# Altium project Quadrotor.PrjPcb (part 1 of 2)
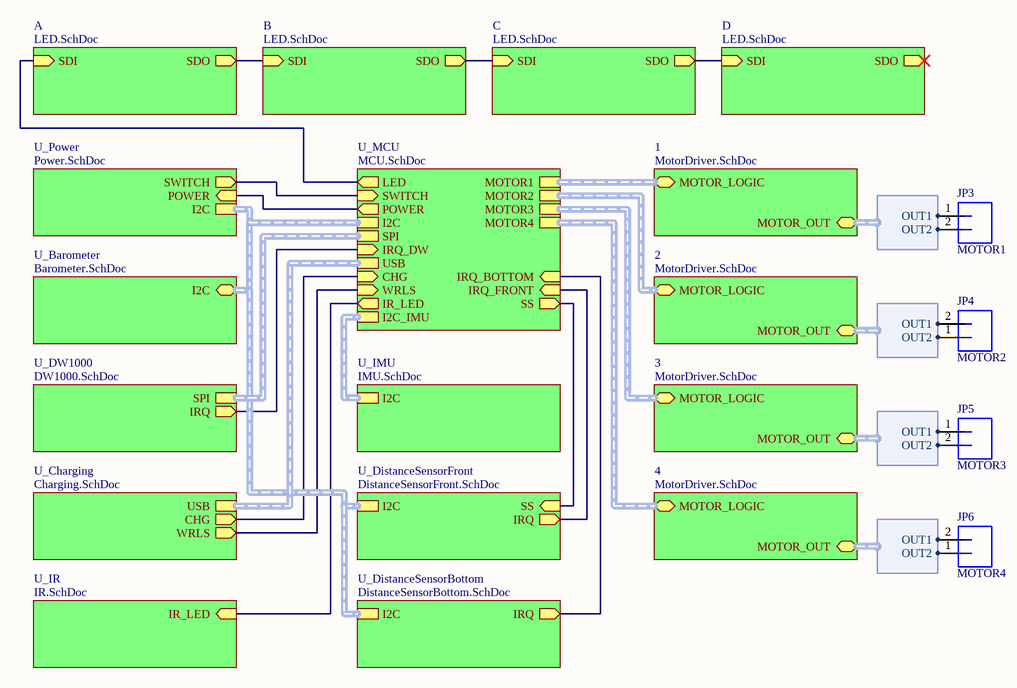
[diagram p0: Quadrotor.SchDoc]
12 sheets, 189 parts. Net scope: hierarchical (ports join the sheet entries above them; power ports are global).
Board file: Quadrotor.PcbDoc
Sheets:
  Quadrotor.SchDoc
    1 = MotorDriver.SchDoc
    2 = MotorDriver.SchDoc
    3 = MotorDriver.SchDoc
    4 = MotorDriver.SchDoc
    A = LED.SchDoc
    D = LED.SchDoc
    B = LED.SchDoc
    C = LED.SchDoc
    U_Barometer = Barometer.SchDoc
    U_DistanceSensorFront = DistanceSensorFront.SchDoc
    U_MCU = MCU.SchDoc
    U_IMU = IMU.SchDoc
    U_Charging = Charging.SchDoc
    U_DW1000 = DW1000.SchDoc
    U_Power = Power.SchDoc
    U_IR = IR.SchDoc
    U_DistanceSensorBottom = DistanceSensorBottom.SchDoc

## Sheet Quadrotor.SchDoc
size A; SheetNumber: 1

### Parts
JP3  MOTOR1  [MOLEX-PICOBLADE-1.25MM-2-HORZ-SMD]
JP4  MOTOR2  [MOLEX-PICOBLADE-1.25MM-2-HORZ-SMD]
JP5  MOTOR3  [MOLEX-PICOBLADE-1.25MM-2-HORZ-SMD]
JP6  MOTOR4  [MOLEX-PICOBLADE-1.25MM-2-HORZ-SMD]

### Sub-sheets
1 = MotorDriver.SchDoc: MOTOR_LOGIC (harness Motor), MOTOR_OUT (harness MotorOutput)
2 = MotorDriver.SchDoc: MOTOR_LOGIC (harness Motor), MOTOR_OUT (harness MotorOutput)
3 = MotorDriver.SchDoc: MOTOR_LOGIC (harness Motor), MOTOR_OUT (harness MotorOutput)
4 = MotorDriver.SchDoc: MOTOR_LOGIC (harness Motor), MOTOR_OUT (harness MotorOutput)
A = LED.SchDoc: SDI (in), SDO (out)
B = LED.SchDoc: SDI (in), SDO (out)
C = LED.SchDoc: SDI (in), SDO (out)
D = LED.SchDoc: SDI (in), SDO (out)
U_Barometer = Barometer.SchDoc: I2C (harness I2C)
U_Charging = Charging.SchDoc: USB (harness USB), CHG (out), WRLS (out)
U_DistanceSensorBottom = DistanceSensorBottom.SchDoc: I2C (harness I2C), IRQ (out)
U_DistanceSensorFront = DistanceSensorFront.SchDoc: I2C (harness I2C), IRQ (out), SS (in)
U_DW1000 = DW1000.SchDoc: SPI (harness SPI), IRQ (out)
U_IMU = IMU.SchDoc: I2C (harness I2C)
U_IR = IR.SchDoc: IR_LED (in)
U_MCU = MCU.SchDoc: USB (harness USB), I2C (harness I2C), SPI (harness SPI), LED (out), CHG (in), I2C_IMU (harness I2C), SWITCH (in), POWER (out), MOTOR1 (harness Motor), MOTOR2 (harness Motor), MOTOR3 (harness Motor), MOTOR4 (harness Motor), SS (out), IRQ_FRONT (in), WRLS (in), IR_LED (out), IRQ_BOTTOM (in), IRQ_DW (in)
U_Power = Power.SchDoc: SWITCH (out), POWER (in), I2C (harness I2C)

### Harnesses
MotorOutput: OUT1, OUT2

### Nets
NetD2_C: sheet U_MCU/CHG, sheet U_Charging/CHG
NetD3_C: sheet U_MCU/WRLS, sheet U_Charging/WRLS
NetJP3_1: JP3.1 ; sheet 1/MOTOR_OUT.OUT1
NetJP3_2: JP3.2 ; sheet 1/MOTOR_OUT.OUT2
NetJP4_1: JP4.1 ; sheet 2/MOTOR_OUT.OUT2
NetJP4_2: JP4.2 ; sheet 2/MOTOR_OUT.OUT1
NetJP5_1: JP5.1 ; sheet 3/MOTOR_OUT.OUT1
NetJP5_2: JP5.2 ; sheet 3/MOTOR_OUT.OUT2
NetJP6_1: JP6.1 ; sheet 4/MOTOR_OUT.OUT2
NetJP6_2: JP6.2 ; sheet 4/MOTOR_OUT.OUT1
NetR6_1: sheet U_MCU/SWITCH, sheet U_Power/SWITCH
NetR6_2: sheet U_MCU/POWER, sheet U_Power/POWER
NetR34_1: sheet U_MCU/IR_LED, sheet U_IR/IR_LED
NetU1_22: sheet A/SDI, sheet U_MCU/LED
NetU1_26: sheet U_MCU/IRQ_BOTTOM, sheet U_DistanceSensorBottom/IRQ
NetU1_27: sheet U_DistanceSensorFront/IRQ, sheet U_MCU/IRQ_FRONT
NetU1_28: sheet U_DistanceSensorFront/SS, sheet U_MCU/SS
NetU1_54: sheet U_MCU/IRQ_DW, sheet U_DW1000/IRQ
NetU10_A_5: sheet A/SDO, sheet B/SDI
NetU10_B_5: sheet B/SDO, sheet C/SDI
NetU10_C_5: sheet D/SDI, sheet C/SDO

### Buses and harness runs
harness sheet 1/MOTOR_LOGIC = sheet U_MCU/MOTOR1
harness sheet 2/MOTOR_LOGIC = sheet U_MCU/MOTOR2
harness sheet 3/MOTOR_LOGIC = sheet U_MCU/MOTOR3
harness sheet 4/MOTOR_LOGIC = sheet U_MCU/MOTOR4
harness sheet U_Barometer/I2C = sheet U_DistanceSensorBottom/I2C = sheet U_DistanceSensorFront/I2C = sheet U_MCU/I2C = sheet U_Power/I2C
harness sheet U_Charging/USB = sheet U_MCU/USB
harness sheet U_DW1000/SPI = sheet U_MCU/SPI
harness sheet U_IMU/I2C = sheet U_MCU/I2C_IMU

### Library data of the parts
JP3-JP6 = MOLEX_PICOBLADE_1.25MM_2_HORZ_SMD: Manufacturer: Molex; PartNumber: 53261-0271; Mounting Technology: Surface Mount; PackageReference: PicoBlade-1.25mm

## Sheet MotorDriver.SchDoc
size A; SheetNumber: 5
Used 4 times, as channels 1, 2, 3, 4. Parts and nets are listed once, with the designators drawn on the sheet.
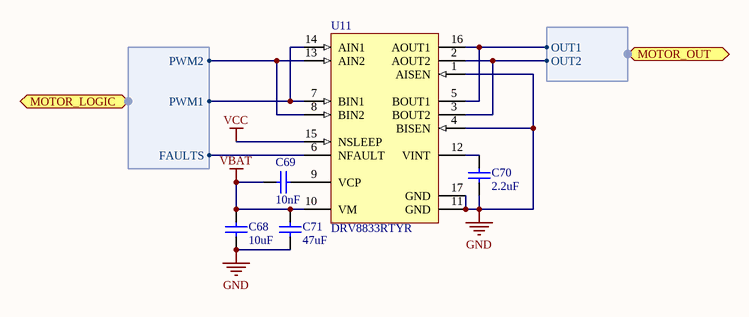
[diagram p1: MotorDriver.SchDoc]

### Parts
C68  value 10uF  [C0603[1608X92]]  (hidden comment: 10uF 16V 0603)
C69  value 10nF  [C0402[1005X55]]  (hidden comment: 10nF 50V 0402)
C70  value 2.2uF  [C0402[1005X55]]  (hidden comment: 2.2uF 6.3V 0402)
C71  value 47uF  [C1206[3216X160]]  (hidden comment: 47uF 6.3V 1206)
U11  DRV8833RTYR  [QFN-16 (0.65mm)]

### Ports
MOTOR_LOGIC (harness Motor), MOTOR_OUT (harness MotorOut)

### Harnesses
Motor: FAULTS, PWM2, PWM1
MotorOut: OUT1, OUT2

### Nets
GND: C68.1 C70.1 C71.2 U11.1(AISEN) U11.4(BISEN) U11.11(GND) U11.17(GND)
VBAT: C68.2 C69.1 C71.1 U11.10(VM)
VCC: U11.15(NSLEEP)
NetC69_2: C69.2 U11.9(VCP)
NetC70_2: C70.2 U11.12(VINT)
NetU11_2: U11.2(AOUT2) U11.3(BOUT2) ; port MOTOR_OUT.OUT2
NetU11_5: U11.5(BOUT1) U11.16(AOUT1) ; port MOTOR_OUT.OUT1
NetU11_6: U11.6(NFAULT) ; port MOTOR_LOGIC.FAULTS
NetU11_7: U11.7(BIN1) U11.14(AIN1) ; port MOTOR_LOGIC.PWM1
NetU11_8: U11.8(BIN2) U11.13(AIN2) ; port MOTOR_LOGIC.PWM2

### Channels
1: designators end in _1
2: designators end in _2
3: designators end in _3
4: designators end in _4

### Library data of the parts
C68 = CAP_10uF_16V_0603_10%: 10uF 16V 10% 0603 (1608 Metric); PartNumber: GRM188R61C106KAALD; Manufacturer: Murata; Mounting Technology: Surface Mount; PackageReference: 0603; PackageDescription: 0603 (1608 Metric); Voltage: 16V; Tolerance: 10%
C69 = CAP_10nF_50V_0402_10%: 10nF 50V 10% 0402 (1005 Metric); PartNumber: GCM155R71H103KA55D; Manufacturer: Murata; Mounting Technology: Surface Mount; PackageReference: 0402; PackageDescription: 0402 (1005 Metric); Voltage: 50V; Tolerance: 10%
C70 = CAP_2.2uF_6.3V_0402_20%: 2.2uF 6.3V 20% 0402 (1005 Metric); PartNumber: GRM155R60J225ME15D; Manufacturer: Murata; Mounting Technology: Surface Mount; PackageReference: 0402; PackageDescription: 0402 (1005 Metric); Voltage: 6.3V; Tolerance: 20%
C71 = CAP_47uF_6.3V_1206_10%: 47uF 6.3V 10% 1206 (3216 Metric); PartNumber: GRM31CR60J476KE19L; Manufacturer: Murata; Mounting Technology: Surface Mount; PackageReference: 1206; PackageDescription: 1206 (3216 Metric); Voltage: 6.3V; Tolerance: 10%
U11 = DRV8833RTYR: Manufacturer: Texas Instruments; Mounting Technology: Surface Mount; PartNumber: DRV8833RTYR; PackageReference: QFN-16

## Sheet LED.SchDoc
size A; SheetNumber: 10
Used 4 times, as channels A, D, B, C. Parts and nets are listed once, with the designators drawn on the sheet.
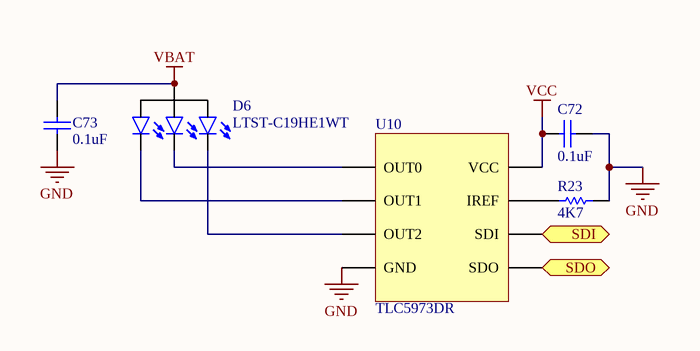
[diagram p2: LED.SchDoc]

### Parts
C72  value 0.1uF  [C0402[1005X55]]  (hidden comment: 0.1uF 6.3V 0402)
C73  value 0.1uF  [C0402[1005X55]]  (hidden comment: 0.1uF 6.3V 0402)
D6  LTST-C19HE1WT  [LED0606]
R23  value 4K7  [R0402[1005]]  (hidden comment: 4K7 1% 0402)
U10  TLC5973DR  [SOIC-8]

### Ports
SDI (in), SDO (out)

### Nets
GND: C72.2 C73.1 R23.1 U10.4(GND)
VBAT: C73.2 D6.4(A)
VCC: C72.1 U10.8(VCC)
SDI: U10.6(SDI) ; port SDI
SDO: U10.5(SDO) ; port SDO
NetD6_1: D6.1(K_Red) U10.3(OUT2)
NetD6_2: D6.2(K_Green) U10.1(OUT0)
NetD6_3: D6.3(K_Blue) U10.2(OUT1)
NetR23_2: R23.2 U10.7(IREF)

### Channels
A: designators end in _A; ports SDI=NetU1_22 SDO=NetU10_A_5
D: designators end in _D; ports SDI=NetU10_C_5 SDO=NetU10_D_5
B: designators end in _B; ports SDI=NetU10_A_5 SDO=NetU10_B_5
C: designators end in _C; ports SDI=NetU10_B_5 SDO=NetU10_C_5

### Library data of the parts
C72 C73 = CAP_0.1uF_6.3V_0402_10%: 0.1uF 6.3V 10% 0402 (1005 Metric); PartNumber: GRM155R70J104KA01D; Manufacturer: Murata; Mounting Technology: Surface Mount; PackageReference: 0402; PackageDescription: 0402 (1005 Metric); Voltage: 6.3V; Tolerance: 10%
D6 = LTST-C19HE1WT: Manufacturer: Lite-On Inc.; PartNumber: LTST-C19HE1WT; PackageReference: 0606; Mounting Technology: Surface Mount; PackageDescription: 0606 (1616 Metric)
R23 = RES_4K7_0402_1%: 4K7 0.063W 1% 0402 (1005 Metric); Manufacturer: KOA Speer; PartNumber: RK73H1ETTP4701F; Tolerance: 1%; Power: 0.063W; Mounting Technology: Surface Mount; PackageReference: 0402; PackageDescription: 0402 (1005 Metric); ComponentLink1Description: Datasheet; ComponentLink1URL: http://www.koaspeer.com/catimages/Products/RK73H/RK73H.pdf
U10 = TLC5973DR: LED Lighting Drivers 3Ch 12B PWM Constant Crnt LED Dvr; Manufacturer: Texas Instruments; PartNumber: TLC5973DR; Mounting Technology: Surface Mount; PackageReference: SOIC-8

## Sheet Barometer.SchDoc
size A; SheetNumber: 9
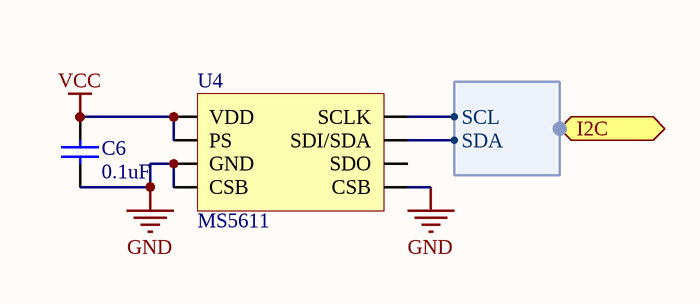
[diagram p3: Barometer.SchDoc]

### Parts
C6  value 0.1uF  [C0402[1005X55]]  (hidden comment: 0.1uF 6.3V 0402)
U4  MS5611  [MS5611]

### Ports
I2C (harness I2C)

### Harnesses
I2C: SCL, SDA

### Nets
GND: C6.1 U4.3(GND) U4.4(CSB) U4.5(CSB)
VCC: C6.2 U4.1(VDD) U4.2(PS)
I2C.SCL: U4.8(SCLK) ; port I2C.SCL
I2C.SDA: U4.7(SDI/SDA) ; port I2C.SDA

Not connected (* = marked no-connect by the designer): U4 6(SDO)

### Library data of the parts
C6 = CAP_0.1uF_6.3V_0402_10%: as C72 on sheet LED; Tolerance: 10%; Mounting Technology: Surface Mount; PackageReference: 0402; PackageDescription: 0402 (1005 Metric); Voltage: 6.3V

## Sheet DistanceSensorFront.SchDoc
size A; SheetNumber: 8
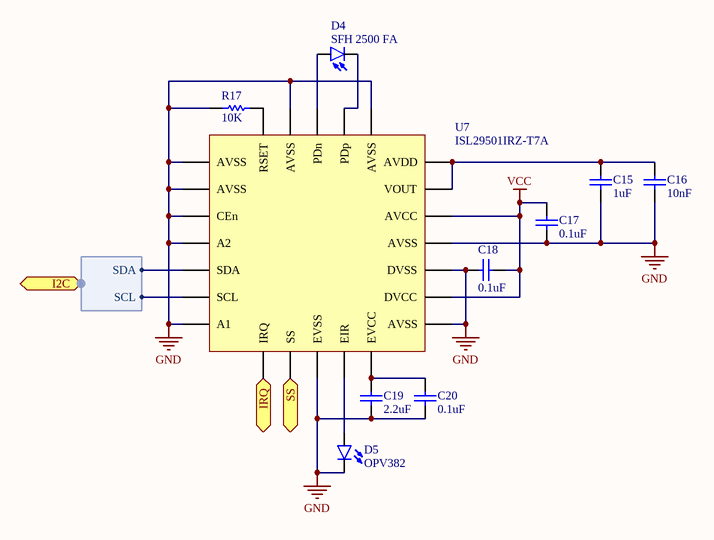
[diagram p4: DistanceSensorFront.SchDoc]

### Parts
C15  value 1uF  [C0402[1005X55]]  (hidden comment: 1uF 6.3V 0402)
C16  value 10nF  [C0402[1005X55]]  (hidden comment: 10nF 50V 0402)
C17  value 0.1uF  [C0402[1005X55]]  (hidden comment: 0.1uF 6.3V 0402)
C18  value 0.1uF  [C0402[1005X55]]  (hidden comment: 0.1uF 6.3V 0402)
C19  value 2.2uF  [C0402[1005X55]]  (hidden comment: 2.2uF 6.3V 0402)
C20  value 0.1uF  [C0402[1005X55]]  (hidden comment: 0.1uF 6.3V 0402)
D4  SFH 2500 FA  [SFH 2500 FA]
D5  OPV382  [OPV382]
R17  value 10K  [R0402[1005]]  (hidden comment: 10K 1% 0402)
U7  ISL29501IRZ-T7A  [QFN-24]

### Ports
I2C (harness I2C), IRQ (out), SS (in)

### Harnesses
I2C: SCL, SDA

### Nets
GND: C15.1 C16.1 C17.2 C18.2 C19.1 C20.1 D5.1(C) R17.1 U7.1(AVSS) U7.2(AVSS) U7.3(CEn) U7.4(A2) U7.7(A1) U7.10(EVSS) U7.13(AVSS) U7.15(DVSS) U7.16(AVSS) U7.20(AVSS) U7.23(AVSS)
VCC: C17.1 C18.1 U7.14(DVCC) U7.17(AVCC)
I2C.SCL: U7.6(SCL) ; port I2C.SCL
I2C.SDA: U7.5(SDA) ; port I2C.SDA
NetC15_2: C15.2 C16.2 U7.18(VOUT) U7.19(AVDD)
NetC19_2: C19.2 C20.2 U7.12(EVCC)
NetD4_1: D4.1(C) U7.21(PDp)
NetD4_2: D4.2(A) U7.22(PDn)
NetD5_2: D5.2(A) U7.11(EIR)
NetR17_2: R17.2 U7.24(RSET)
NetU1_27: U7.8(IRQ) ; port IRQ
NetU1_28: U7.9(SS) ; port SS

### Library data of the parts
C15 = CAP_1uF_6.3V_0402_10%: 1uF 6.3V 10% 0402 (1005 Metric); PartNumber: GRM155R70J105KA12D; Manufacturer: Murata; Mounting Technology: Surface Mount; PackageReference: 0402; PackageDescription: 0402 (1005 Metric); Voltage: 6.3V; Tolerance: 10%
C16 = CAP_10nF_50V_0402_10%: as C69 on sheet MotorDriver; Mounting Technology: Surface Mount; PackageReference: 0402; PackageDescription: 0402 (1005 Metric); Voltage: 50V; Tolerance: 10%
C17 C18 C20 = CAP_0.1uF_6.3V_0402_10%: as C72 on sheet LED; Mounting Technology: Surface Mount; PackageReference: 0402; PackageDescription: 0402 (1005 Metric); Voltage: 6.3V; Tolerance: 10%
C19 = CAP_2.2uF_6.3V_0402_20%: as C70 on sheet MotorDriver; Mounting Technology: Surface Mount; PackageReference: 0402; PackageDescription: 0402 (1005 Metric); Voltage: 6.3V; Tolerance: 20%
D4 = SFH 2500 FA: Manufacturer: Osram; PartNumber: SFH 2500 FA; Mounting Technology: Surface Mount
D5 = OPV382: Manufacturer: OPTEK Technology; PartNumber: OPV382; Mounting Technology: Through Hole
R17 = RES_10K_0402_1%: 10K 0.063W 1% 0402 (1005 Metric); Manufacturer: KOA Speer; PartNumber: RK73H1ETTP1002F; Tolerance: 1%; Power: 0.063W; Mounting Technology: Surface Mount; PackageReference: 0402; PackageDescription: 0402 (1005 Metric); ComponentLink1Description: Datasheet; ComponentLink1URL: http://www.koaspeer.com/catimages/Products/RK73H/RK73H.pdf
U7 = ISL29501IRZ-T7A: IC TOF SIGNAL PROCESSOR 24QFN; pin to pad: 23>23+25; Manufacturer: Intersil; PartNumber: ISL29501IRZ-T7A; Mounting Technology: Surface Mount; PackageReference: QFN-24

## Sheet MCU.SchDoc
size A; SheetNumber: 2
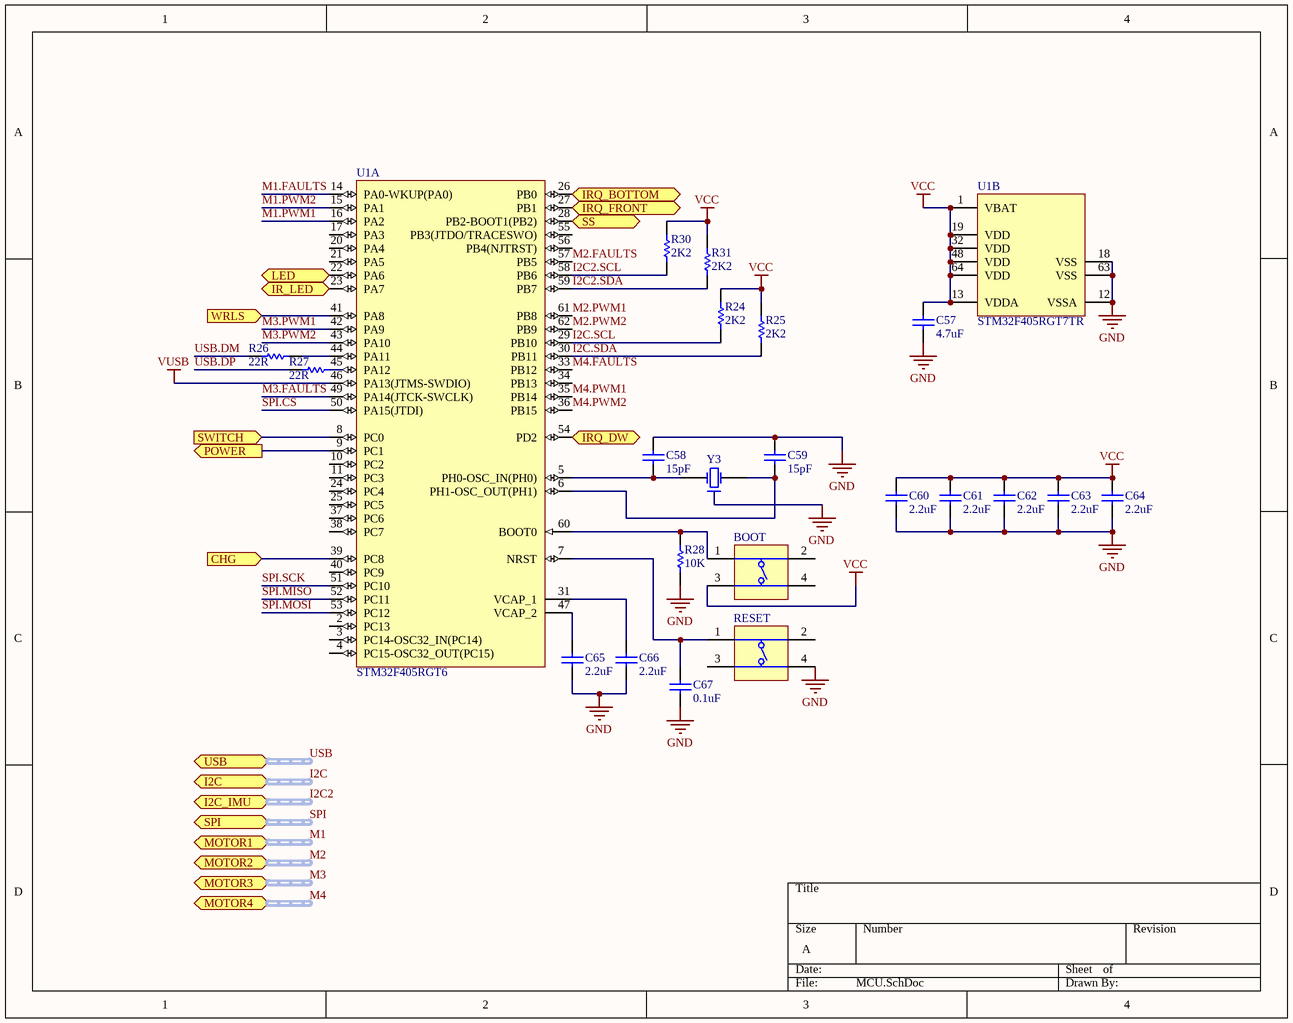
[diagram p5: MCU.SchDoc]

### Parts
BOOT  (no value)  [SWITCH]
C57  value 4.7uF  [C0402[1005X55]]  (hidden comment: 4.7uF 6.3V 0402)
C58  value 15pF  [C0402[1005X55]]  (hidden comment: 15pF 50V 0402)
C59  value 15pF  [C0402[1005X55]]  (hidden comment: 15pF 50V 0402)
C60  value 2.2uF  [C0402[1005X55]]  (hidden comment: 2.2uF 6.3V 0402)
C61  value 2.2uF  [C0402[1005X55]]  (hidden comment: 2.2uF 6.3V 0402)
C62  value 2.2uF  [C0402[1005X55]]  (hidden comment: 2.2uF 6.3V 0402)
C63  value 2.2uF  [C0402[1005X55]]  (hidden comment: 2.2uF 6.3V 0402)
C64  value 2.2uF  [C0402[1005X55]]  (hidden comment: 2.2uF 6.3V 0402)
C65  value 2.2uF  [C0402[1005X55]]  (hidden comment: 2.2uF 6.3V 0402)
C66  value 2.2uF  [C0402[1005X55]]  (hidden comment: 2.2uF 6.3V 0402)
C67  value 0.1uF  [C0402[1005X55]]  (hidden comment: 0.1uF 6.3V 0402)
R24  value 2K2  [R0402[1005]]  (hidden comment: 2K2 1% 0402)
R25  value 2K2  [R0402[1005]]  (hidden comment: 2K2 1% 0402)
R26  value 22R  [R0402[1005]]  (hidden comment: 22R 1% 0402)
R27  value 22R  [R0402[1005]]  (hidden comment: 22R 1% 0402)
R28  value 10K  [R0402[1005]]  (hidden comment: 10K 1% 0402)
R30  value 2K2  [R0402[1005]]  (hidden comment: 2K2 1% 0402)
R31  value 2K2  [R0402[1005]]  (hidden comment: 2K2 1% 0402)
RESET  (no value)  [SWITCH]
U1  STM32F405RGT6  [STM-LQFP64_L]  (parts A,B of 2)
Y3  (no value)  [ABRA-ABM3B-4_V]

### Ports
CHG (in), I2C (harness I2C), I2C_IMU (harness I2C), IR_LED (out), IRQ_BOTTOM (in), IRQ_DW (in), IRQ_FRONT (in), LED (out), MOTOR1 (harness Motor), MOTOR2 (harness Motor), MOTOR3 (harness Motor), MOTOR4 (harness Motor), POWER (out), SPI (harness SPI), SS (out), SWITCH (in), USB (harness USB), WRLS (in)

### Nets
GND: C57.1 C58.2 C59.2 C60.1 C61.1 C62.1 C63.1 C64.1 C65.1 C66.1 C67.1 R28.1 RESET.4(T3) U1.12(VSSA) U1.18(VSS) U1.63(VSS) Y3.2
VCC: BOOT.3(T3) C57.2 C60.2 C61.2 C62.2 C63.2 C64.2 R24.2 R25.2 R30.2 R31.2 U1.1(VBAT) U1.13(VDDA) U1.19(VDD) U1.32(VDD) U1.48(VDD) U1.64(VDD)
VUSB: U1.46(PA13(JTMS-SWDIO))
I2C2.SCL: R30.1 U1.58(PB6)
I2C2.SDA: R31.1 U1.59(PB7)
I2C.SCL: R24.1 U1.29(PB10)
I2C.SDA: R25.1 U1.30(PB11)
M1.FAULTS: U1.14(PA0-WKUP(PA0))
M1.PWM1: U1.16(PA2)
M1.PWM2: U1.15(PA1)
M2.FAULTS: U1.57(PB5)
M2.PWM1: U1.61(PB8)
M2.PWM2: U1.62(PB9)
M3.FAULTS: U1.49(PA14(JTCK-SWCLK))
M3.PWM1: U1.42(PA9)
M3.PWM2: U1.43(PA10)
M4.FAULTS: U1.33(PB12)
M4.PWM1: U1.35(PB14)
M4.PWM2: U1.36(PB15)
SPI.CS: U1.50(PA15(JTDI))
SPI.MISO: U1.52(PC11)
SPI.MOSI: U1.53(PC12)
SPI.SCK: U1.51(PC10)
USB.DM: R26.1
USB.DP: R27.1
NetBOOT_1: BOOT.1(T1) R28.2 U1.60(BOOT0)
NetC58_1: C58.1 U1.5(PH0-OSC_IN(PH0)) Y3.3(X2)
NetC59_1: C59.1 U1.6(PH1-OSC_OUT(PH1)) Y3.1(X1)
NetC65_2: C65.2 U1.47(VCAP_2)
NetC66_2: C66.2 U1.31(VCAP_1)
NetC67_2: C67.2 RESET.1(T1) U1.7(NRST)
NetD2_C: U1.39(PC8) ; port CHG
NetD3_C: U1.41(PA8) ; port WRLS
NetR6_1: U1.8(PC0) ; port SWITCH
NetR6_2: U1.9(PC1) ; port POWER
NetR26_2: R26.2 U1.44(PA11)
NetR27_2: R27.2 U1.45(PA12)
NetR34_1: U1.23(PA7) ; port IR_LED
NetU1_22: U1.22(PA6) ; port LED
NetU1_26: U1.26(PB0) ; port IRQ_BOTTOM
NetU1_27: U1.27(PB1) ; port IRQ_FRONT
NetU1_28: U1.28(PB2-BOOT1(PB2)) ; port SS
NetU1_54: U1.54(PD2) ; port IRQ_DW

Not connected (* = marked no-connect by the designer): BOOT 2(T2) 4(T3); RESET 2(T2) 3(T3); U1 2(PC13) 3(PC14-OSC32_IN(PC14)) 4(PC15-OSC32_OUT(PC15)) 10(PC2) 11(PC3) 17(PA3) 20(PA4) 21(PA5) 24(PC4) 25(PC5) 34(PB13) 37(PC6) 38(PC7) 40(PC9) 55(PB3(JTDO/TRACESWO)) 56(PB4(NJTRST))

### Buses and harness runs
harness I2C2 = port I2C_IMU
harness I2C = port I2C
harness M1 = port MOTOR1
harness M2 = port MOTOR2
harness M3 = port MOTOR3
harness M4 = port MOTOR4
harness SPI = port SPI
harness USB = port USB

### Library data of the parts
BOOT RESET = DIPT-DTSM-6: Switch, SPNO Push Button SMD; Manufacturer: C&K Components; PartNumber: PTS810 SJM 250 SMTR LFS; Packing Type: Tape&Reel; Mechanical Life: 200,000 cycles; ComponentLink2URL: http://www.dip.com.tw/Products_tact.htm; ComponentLink1URL: http://www.dip.com.tw/; ComponentLink3URL: http://www.dip.com.tw/PDF/pro_tact/DTSM_G_-6_2_-V.pdf; PackageDescription: Switch, Surface Mount, 4 Leads, Body 4.6x2.8mm, Height 1.9mm; ComponentLink2Description: Datasheet; ComponentLink3Description: Package Specification; ComponentLink1Description: Manufacturer URL; PackageReference: PTS810; Mounting Technology: Surface Mount
C57 = CAP_4.7uF_6.3V_0402_20%: 4.7uF 6.3V 20% 0402 (1005 Metric); PartNumber: GRM155R60J475ME47D; Manufacturer: Murata; Tolerance: 20%; Mounting Technology: Surface Mount; PackageReference: 0402; PackageDescription: 0402 (1005 Metric); Voltage: 6.3V
C58 C59 = CAP_15pF_50V_0402_5%: 15pF 50V 5% 0402 (1005 Metric); PartNumber: GRM1555C1H150JA01D; Manufacturer: Murata; Tolerance: 5%; Mounting Technology: Surface Mount; PackageReference: 0402; PackageDescription: 0402 (1005 Metric); Voltage: 50V
C60-C66 = CAP_2.2uF_6.3V_0402_20%: as C70 on sheet MotorDriver; Tolerance: 20%; Mounting Technology: Surface Mount; PackageReference: 0402; PackageDescription: 0402 (1005 Metric); Voltage: 6.3V
C67 = CAP_0.1uF_6.3V_0402_10%: as C72 on sheet LED; Tolerance: 10%; Mounting Technology: Surface Mount; PackageReference: 0402; PackageDescription: 0402 (1005 Metric); Voltage: 6.3V
R24 R25 R30 R31 = RES_2K2_0402_1%: 2K2 0.063W 1% 0402 (1005 Metric); Manufacturer: KOA Speer; PartNumber: RK73H1ETTP2201F; Tolerance: 1%; Power: 0.063W; Mounting Technology: Surface Mount; PackageReference: 0402; PackageDescription: 0402 (1005 Metric); ComponentLink1Description: Datasheet; ComponentLink1URL: http://www.koaspeer.com/catimages/Products/RK73H/RK73H.pdf
R26 R27 = RES_22R_0402_1%: 22R 0.063W 1% 0402 (1005 Metric); Manufacturer: KOA Speer; PartNumber: RK73H1ETTP22R0F; Power: 0.063W; Tolerance: 1%; Mounting Technology: Surface Mount; PackageReference: 0402; PackageDescription: 0402 (1005 Metric); ComponentLink1Description: Datasheet; ComponentLink1URL: http://www.koaspeer.com/catimages/Products/RK73H/RK73H.pdf
R28 = RES_10K_0402_1%: as R17 on sheet DistanceSensorFront; Tolerance: 1%; Power: 0.063W; Mounting Technology: Surface Mount; PackageReference: 0402; PackageDescription: 0402 (1005 Metric); ComponentLink1Description: Datasheet; ComponentLink1URL: http://www.koaspeer.com/catimages/Products/RK73H/RK73H.pdf
U1 = CMP-0243-00089-2: ARM Cortex-M4 32-bit MCU+FPU, 210 DMIPS, 1024 kB Flash, 192 kB Internal RAM, 51 I/Os, 64-pin LQFP, -40 to 105 degC, Tape and Reel; Manufacturer: STMicroelectronics; FLASH Size (Prog) (kB): 1024; Supply Voltage(Vcc) max (V): 3.6; Internal RAM Size (kB): 192; Supply Voltage(Vcc) min (V): 1.8; Operating Frequency(F) (Processor speed) (MHz): 168; D/A Converter: 2x12-bit; I/Os (High Current): 51; ComponentLink2Description: Datasheet; Core: ARM Cortex-M4; PackageVersion: Rev. 4, 06/2013; ComponentLink1URL: http://www.st.com/web/en/home.html; PackageReference: LQFP64; Mounting Technology: Surface Mount; ComponentLink1Description: Manufacturer URL; PackageDescription: 64-Pin Low Profile Quad Flat Package, 10 x 10 mm Body, 0.5 mm Pitch; ComponentLink3Description: Package Specification; ComponentLink2URL: http://www.st.com/st-web-ui/static/active/en/resource/technical/document/datasheet/DM00037051.pdf; PartNumber: STM32F405RGT6; ComponentLink3URL: http://www.st.com/st-web-ui/static/active/en/resource/technical/document/datasheet/DM00037051.pdf; Packing: Tape and Reel; DatasheetVersion: Rev. 4; PartId: 1
Y3 = ABRA-ABM3B-4: PartNumber: ABM3B-8.000MHZ-10-1UT; Manufacturer: ABRACON; Mounting Technology: Surface Mount; PackageReference: 2012; PackageDescription: 2012 (5032 metric)

## Sheet IMU.SchDoc
size A; SheetNumber: 7
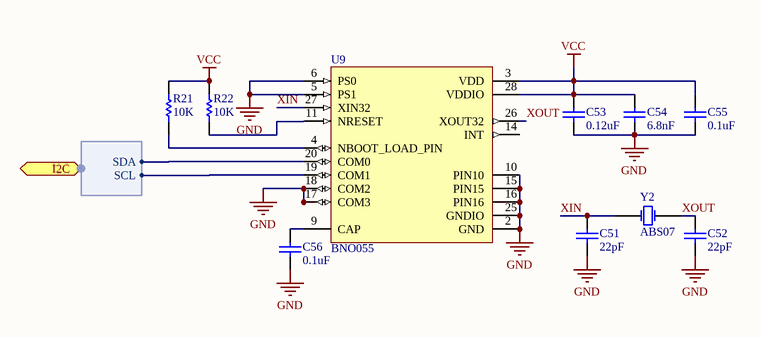
[diagram p6: IMU.SchDoc]

### Parts
C51  value 22pF  [C0402[1005X55]]  (hidden comment: 22pF 50V 0402)
C52  value 22pF  [C0402[1005X55]]  (hidden comment: 22pF 50V 0402)
C53  value 0.12uF  [C0402[1005X55]]  (hidden comment: 0.12uF 6.3V 0402)
C54  value 6.8nF  [C0402[1005X55]]  (hidden comment: 6.8nF 50V 0402)
C55  value 0.1uF  [C0402[1005X55]]  (hidden comment: 0.1uF 6.3V 0402)
C56  value 0.1uF  [C0402[1005X55]]  (hidden comment: 0.1uF 6.3V 0402)
R21  value 10K  [R0402[1005]]  (hidden comment: 10K 1% 0402)
R22  value 10K  [R0402[1005]]  (hidden comment: 10K 1% 0402)
U9  BNO055  [LGA28R50P4X10_380X520X100]
Y2  ABS07  [ABS07]

### Ports
I2C (harness I2C)

### Harnesses
I2C: SCL, SDA

### Nets
GND: C51.1 C52.1 C53.1 C54.1 C55.1 C56.1 U9.2(GND) U9.5(PS1) U9.6(PS0) U9.10(PIN10) U9.15(PIN15) U9.16(PIN16) U9.17(COM3) U9.18(COM2) U9.25(GNDIO)
VCC: C53.2 C54.2 C55.2 R21.2 R22.2 U9.3(VDD) U9.28(VDDIO)
I2C2.SCL: U9.19(COM1) ; port I2C.SCL
I2C2.SDA: U9.20(COM0) ; port I2C.SDA
XIN: C51.2 U9.27(XIN32) Y2.1(X1)
XOUT: C52.2 U9.26(XOUT32) Y2.2(X2)
NetC56_2: C56.2 U9.9(CAP)
NetR21_1: R21.1 U9.4(NBOOT_LOAD_PIN)
NetR22_1: R22.1 U9.11(NRESET)

Not connected (* = marked no-connect by the designer): U9 14(INT)

### Library data of the parts
C51 C52 = CAP_22pF_50V_0402_1%: 22pF 50V 1% 0402 (1005 Metric); PartNumber: GRM1555C1H220FA01D; Manufacturer: Murata; Tolerance: 1%; Mounting Technology: Surface Mount; PackageReference: 0402; PackageDescription: 0402 (1005 Metric); Voltage: 50V
C53 = CAP_0.12uF_6.3V_0402_10%: 0.12uF 6.3V 10% 0402 (1005 Metric); PartNumber: GRM155R60J124KE01D; Manufacturer: Murata; Tolerance: 10%; Mounting Technology: Surface Mount; PackageReference: 0402; PackageDescription: 0402 (1005 Metric); Voltage: 6.3V
C54 = CAP_6.8nF_50V_0402_10%: 6.8nF 50V 10% 0402 (1005 Metric); PartNumber: GRM155R71H682KA88J; Manufacturer: Murata; Tolerance: 10%; Mounting Technology: Surface Mount; PackageReference: 0402; PackageDescription: 0402 (1005 Metric); Voltage: 50V
C55 C56 = CAP_0.1uF_6.3V_0402_10%: as C72 on sheet LED; Tolerance: 10%; Mounting Technology: Surface Mount; PackageReference: 0402; PackageDescription: 0402 (1005 Metric); Voltage: 6.3V
R21 R22 = RES_10K_0402_1%: as R17 on sheet DistanceSensorFront; Tolerance: 1%; Power: 0.063W; Mounting Technology: Surface Mount; PackageReference: 0402; PackageDescription: 0402 (1005 Metric); ComponentLink1Description: Datasheet; ComponentLink1URL: http://www.koaspeer.com/catimages/Products/RK73H/RK73H.pdf
Y2 = ABS07: Manufacturer: Abracon; PartNumber: ABS07-32.768KHZ-T; Mounting Technology: Surface Mount; PackageReference: 2-SMD
U9 = BNO055: Value: *

## Sheet Charging.SchDoc
size A; SheetNumber: 4
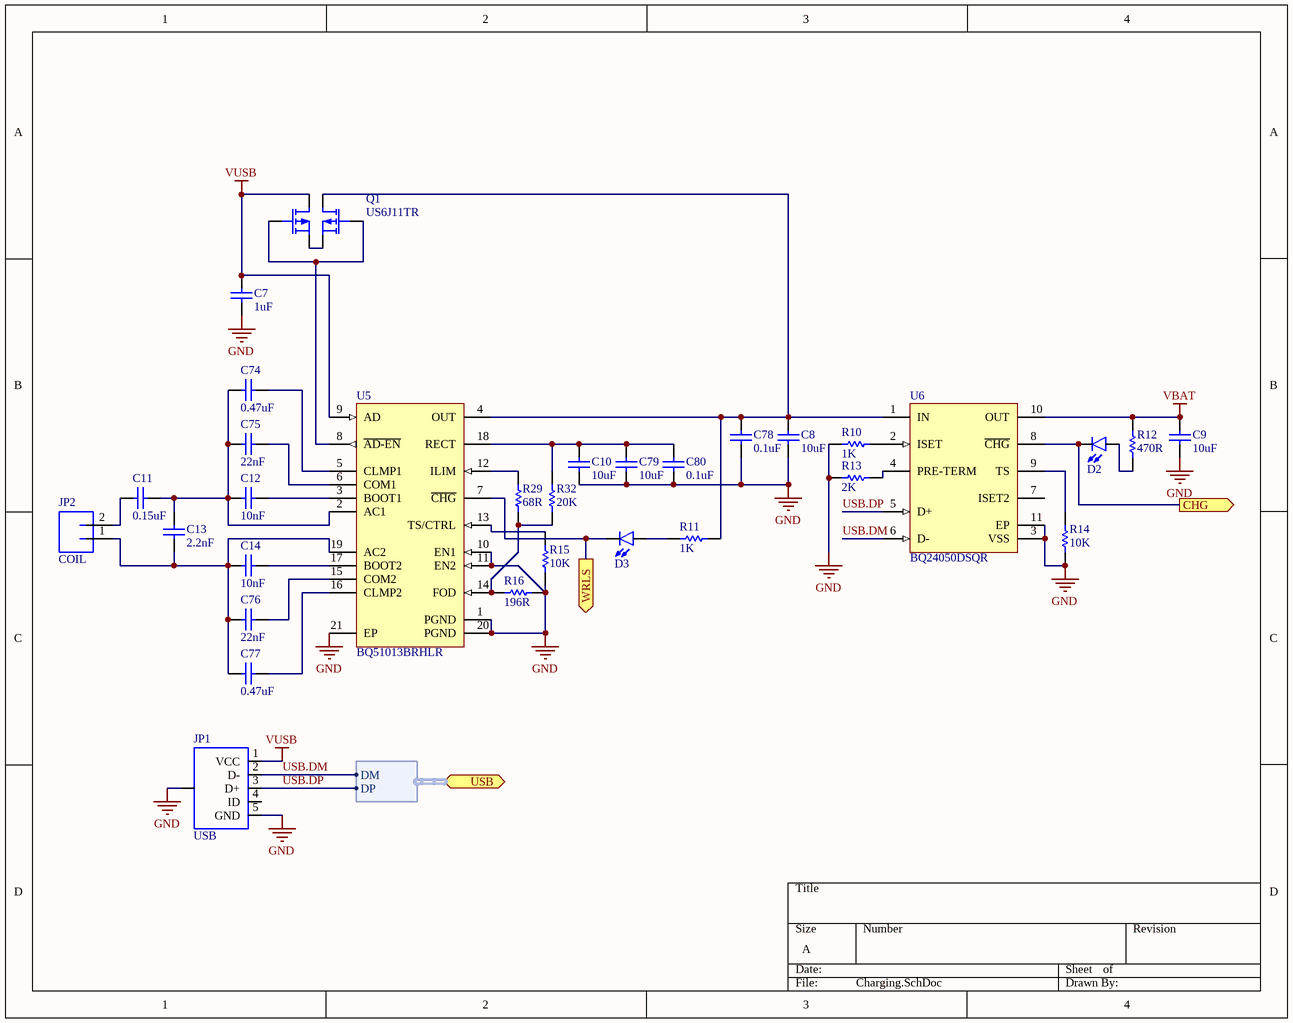
[diagram p7: Charging.SchDoc]

### Parts
C7  value 1uF  [C0402[1005X55]]  (hidden comment: 1uF 6.3V 0402)
C8  value 10uF  [C0402[1005X55]]  (hidden comment: 10uF 6.3V 0402)
C9  value 10uF  [C0402[1005X55]]  (hidden comment: 10uF 6.3V 0402)
C10  value 10uF  [C0603[1608X92]]  (hidden comment: 10uF 16V 0603)
C11  value 0.15uF  [C0402[1005X55]]  (hidden comment: 0.15uF 25V 0402)
C12  value 10nF  [C0402[1005X55]]  (hidden comment: 10nF 50V 0402)
C13  value 2.2nF  [C0402[1005X55]]  (hidden comment: 2.2nF 50V 0402)
C14  value 10nF  [C0402[1005X55]]  (hidden comment: 10nF 50V 0402)
C74  value 0.47uF  [C0402[1005X55]]  (hidden comment: 0.47uF 25V 0402)
C75  value 22nF  [C0402[1005X55]]  (hidden comment: 22nF 50V 0402)
C76  value 22nF  [C0402[1005X55]]  (hidden comment: 22nF 50V 0402)
C77  value 0.47uF  [C0402[1005X55]]  (hidden comment: 0.47uF 25V 0402)
C78  value 0.1uF  [C0402[1005X55]]  (hidden comment: 0.1uF 6.3V 0402)
C79  value 10uF  [C0603[1608X92]]  (hidden comment: 10uF 16V 0603)
C80  value 0.1uF  [C0402[1005X55]]  (hidden comment: 0.1uF 100V 0402)
D2  LED_0603_GREEN_5mA  [LED0603]  (value not drawn)
D3  LED_0603_ORANGE_5mA  [LED0603]  (value not drawn)
JP1  USB  [USB-MICROB]
JP2  COIL  [JST-SH-2-SMD-HORZ]
Q1  US6J11TR  [SOT-363-6FL]
R10  value 1K  [R0402[1005]]  (hidden comment: 1K 1% 0402)
R11  value 1K  [R0402[1005]]  (hidden comment: 1K 1% 0402)
R12  value 470R  [R0402[1005]]  (hidden comment: 470R 1% 0402)
R13  value 2K  [R0402[1005]]  (hidden comment: 2K 1% 0402)
R14  value 10K  [R0402[1005]]  (hidden comment: 10K 1% 0402)
R15  value 10K  [R0402[1005]]  (hidden comment: 10K 1% 0402)
R16  value 196R  [R0402[1005]]  (hidden comment: 196R 1% 0402)
R29  value 68R  [R0402[1005]]  (hidden comment: 68R 1% 0402)
R32  value 20K  [R0402[1005]]  (hidden comment: 20K 1% 0402)
U5  BQ51013BRHLR  [VQFN-20]
U6  BQ24050DSQR  [WSON-10]

### Ports
CHG (out), USB (harness USB), WRLS (out)

### Harnesses
USB: DM, DP

### Nets
GND: C7.1 C8.1 C9.1 C10.1 C78.1 C79.1 C80.1 JP1.5(GND) JP1.6(SHIELD) R10.1 R13.1 R14.1 R15.1 R16.2 U5.1(PGND) U5.10(EN1) U5.11(EN2) U5.20(PGND) U5.21(EP) U6.3(VSS) U6.11(EP)
VBAT: C9.2 R12.2 U6.10(OUT)
VUSB: C7.2 JP1.1(VCC) Q1.3(D2) U5.9(AD)
USB.DM: JP1.2(D-) U6.6(D-) ; port USB.DM
USB.DP: JP1.3(D+) U6.5(D+) ; port USB.DP
NetC8_2: C8.2 C78.2 Q1.6(D1) R11.1 U5.4(OUT) U6.1(IN)
NetC10_2: C10.2 C79.2 C80.2 R32.2 U5.18(RECT)
NetC11_1: C11.1 JP2.2
NetC11_2: C11.2 C12.2 C13.2 C74.1 C75.1 U5.2(AC1)
NetC12_1: C12.1 U5.3(BOOT1)
NetC13_1: C13.1 C14.2 C76.1 C77.1 JP2.1 U5.19(AC2)
NetC14_1: C14.1 U5.17(BOOT2)
NetC74_2: C74.2 U5.5(CLMP1)
NetC75_2: C75.2 U5.6(COM1)
NetC76_2: C76.2 U5.15(COM2)
NetC77_2: C77.2 U5.16(CLMP2)
NetD2_A: D2.A R12.1
NetD2_C: D2.C U6.8(~{CHG}) ; port CHG
NetD3_A: D3.A R11.2
NetD3_C: D3.C U5.7(~{CHG}) ; port WRLS
NetQ1_1: Q1.1(S1) Q1.4(S2)
NetQ1_2: Q1.2(G1) Q1.5(G2) U5.8(~{AD-EN})
NetR10_2: R10.2 U6.2(ISET)
NetR13_2: R13.2 U6.4(PRE-TERM)
NetR14_2: R14.2 U6.9(TS)
NetR15_2: R15.2 U5.13(TS/CTRL)
NetR16_1: R16.1 R29.1 R32.1 U5.14(FOD)
NetR29_2: R29.2 U5.12(ILIM)

Not connected (* = marked no-connect by the designer): JP1 4(ID); U6 7(ISET2)

### Library data of the parts
C7 = CAP_1uF_6.3V_0402_10%: as C15 on sheet DistanceSensorFront; Mounting Technology: Surface Mount; PackageReference: 0402; PackageDescription: 0402 (1005 Metric); Voltage: 6.3V; Tolerance: 10%
C8 C9 = CAP_10uF_6.3V_0402_20%: 10uF 6.3V 20% 0402 (1005 Metric); PartNumber: GRM155R60J106ME44D; Manufacturer: Murata; Mounting Technology: Surface Mount; PackageReference: 0402; PackageDescription: 0402 (1005 Metric); Voltage: 6.3V; Tolerance: 20%
C10 C79 = CAP_10uF_16V_0603_10%: as C68 on sheet MotorDriver; Mounting Technology: Surface Mount; PackageReference: 0603; PackageDescription: 0603 (1608 Metric); Voltage: 16V; Tolerance: 10%
C11 = CAP_0.15uF_25V_0402_10%: 0.15uF 25V 10% 0402 (1005 Metric); PartNumber: C1005X6S1E154K050BC; Manufacturer: TDK; Mounting Technology: Surface Mount; PackageReference: 0402; PackageDescription: 0402 (1005 Metric); Voltage: 25V; Tolerance: 10%
C12 C14 = CAP_10nF_50V_0402_10%: as C69 on sheet MotorDriver; Mounting Technology: Surface Mount; PackageReference: 0402; PackageDescription: 0402 (1005 Metric); Voltage: 50V; Tolerance: 10%
C13 = CAP_2.2nF_50V_0402_10%: 2.2nF 50V 10% 0402 (1005 Metric); PartNumber: GCM155R71H222KA37D; Manufacturer: Murata; Mounting Technology: Surface Mount; PackageReference: 0402; PackageDescription: 0402 (1005 Metric); Voltage: 50V; Tolerance: 10%
C74 C77 = CAP_0.47uF_25V_0402_10%: 0.47uF 25V 10% 0402 (1005 Metric); PartNumber: GRM155R61E474KE01D; Manufacturer: Murata; Mounting Technology: Surface Mount; PackageReference: 0402; PackageDescription: 0402 (1005 Metric); Voltage: 25V; Tolerance: 10%
C75 C76 = CAP_22nF_50V_0402_10%: 22nF 50V 10% 0402 (1005 Metric); PartNumber: GRM155R71H223KA12J; Manufacturer: Murata; Mounting Technology: Surface Mount; PackageReference: 0402; PackageDescription: 0402 (1005 Metric); Voltage: 50V; Tolerance: 10%
C78 = CAP_0.1uF_6.3V_0402_10%: as C72 on sheet LED; Mounting Technology: Surface Mount; PackageReference: 0402; PackageDescription: 0402 (1005 Metric); Voltage: 6.3V; Tolerance: 10%
C80 = CAP_0.1uF_100V_0402_10%: 0.1uF 100V 10% 0402 (1005 Metric); PartNumber: GRM155R62A104KE14D; Manufacturer: Murata; Mounting Technology: Surface Mount; PackageReference: 0402; PackageDescription: 0402 (1005 Metric); Voltage: 100V; Tolerance: 10%
D2 = LED_0603_GREEN_5mA: PartNumber: LTST-C193TGKT-5A; Manufacturer: Lite-On Inc.; PackageReference: 0603; PackageDescription: 0603 (1608 Metric); Mounting Technology: Surface Mount
D3 = LED_0603_ORANGE_5mA: PartNumber: LTST-C193KFKT-5A; Manufacturer: Lite-On Inc.; PackageReference: 0603; PackageDescription: 0603 (1608 Metric); Mounting Technology: Surface Mount
JP1 = USB_MICROB_SMT: pin to pad: 1>VBUS 2>D- 3>D+ 4>ID 5>GND 6>MT1+P$1+P$2+MT2; PartNumber: 10118192-0001LF; Manufacturer: Amphenol FCI; Mounting Technology: Surface Mount; PackageReference: USB - Micro B
JP2 = JST_SH_2_HORZ: Manufacturer: JST Sales America, Inc.; PartNumber: SM02B-SRSS-TB; Mounting Technology: Surface Mount; PackageReference: JST-SH
Q1 = US6J11TR: P-Channel MOSFET; Manufacturer: ON Semiconductor; Mounting Technology: Surface Mount; PartNumber: US6J11TR; PackageReference: TUMT-6
R10 R11 = RES_1K_0402_1%: 1K 0.063W 1% 0402 (1005 Metric); Manufacturer: KOA Speer; PartNumber: RK73H1ETTP1001F; Tolerance: 1%; Power: 0.063W; Mounting Technology: Surface Mount; PackageReference: 0402; PackageDescription: 0402 (1005 Metric); ComponentLink1Description: Datasheet; ComponentLink1URL: http://www.koaspeer.com/catimages/Products/RK73H/RK73H.pdf
R12 = RES_470R_0402_1%: 470R 0.063W 1% 0402 (1005 Metric); Manufacturer: KOA Speer; PartNumber: RK73H1ETTP4700F; Tolerance: 1%; Power: 0.063W; Mounting Technology: Surface Mount; PackageReference: 0402; PackageDescription: 0402 (1005 Metric); ComponentLink1Description: Datasheet; ComponentLink1URL: http://www.koaspeer.com/catimages/Products/RK73H/RK73H.pdf
R13 = RES_2K_0402_1%: 2K 0.063W 1% 0402 (1005 Metric); Manufacturer: KOA Speer; PartNumber: RK73H1ETTP2001F; Tolerance: 1%; Power: 0.063W; Mounting Technology: Surface Mount; PackageReference: 0402; PackageDescription: 0402 (1005 Metric); ComponentLink1Description: Datasheet; ComponentLink1URL: http://www.koaspeer.com/catimages/Products/RK73H/RK73H.pdf
R14 R15 = RES_10K_0402_1%: as R17 on sheet DistanceSensorFront; Tolerance: 1%; Power: 0.063W; Mounting Technology: Surface Mount; PackageReference: 0402; PackageDescription: 0402 (1005 Metric); ComponentLink1Description: Datasheet; ComponentLink1URL: http://www.koaspeer.com/catimages/Products/RK73H/RK73H.pdf
R16 = RES_196R_0402_1%: 196R 0.063W 1% 0402 (1005 Metric); Manufacturer: KOA Speer; PartNumber: RK73H1ETTP1960F; Tolerance: 1%; Power: 0.063W; Mounting Technology: Surface Mount; PackageReference: 0402; PackageDescription: 0402 (1005 Metric); ComponentLink1Description: Datasheet; ComponentLink1URL: http://www.koaspeer.com/catimages/Products/RK73H/RK73H.pdf
R29 = RES_68R_0402_1%: 68R 0.063W 1% 0402 (1005 Metric); Manufacturer: KOA Speer; PartNumber: RK73H1ETTP68R0F; Tolerance: 1%; Power: 0.063W; Mounting Technology: Surface Mount; PackageReference: 0402; PackageDescription: 0402 (1005 Metric); ComponentLink1Description: Datasheet; ComponentLink1URL: http://www.koaspeer.com/catimages/Products/RK73H/RK73H.pdf
R32 = RES_20K_0402_1%: 20K 0.063W 1% 0402 (1005 Metric); Manufacturer: KOA Speer; PartNumber: RK73H1ETTP2002F; Tolerance: 1%; Power: 0.063W; Mounting Technology: Surface Mount; PackageReference: 0402; PackageDescription: 0402 (1005 Metric); ComponentLink1Description: Datasheet; ComponentLink1URL: http://www.koaspeer.com/catimages/Products/RK73H/RK73H.pdf
U5 = BQ51013BRHLR: Manufacturer: Texas Instruments; Mounting Technology: Surface Mount; PartNumber: BQ51013BRHLR; PackageReference: VQFN-20
U6 = BQ24050DSQR: Manufacturer: Texas Instruments; PartNumber: BQ24050DSQR; Mounting Technology: Surface Mount; PackageReference: WSON-10

## Sheet DW1000.SchDoc
size A; SheetNumber: 6
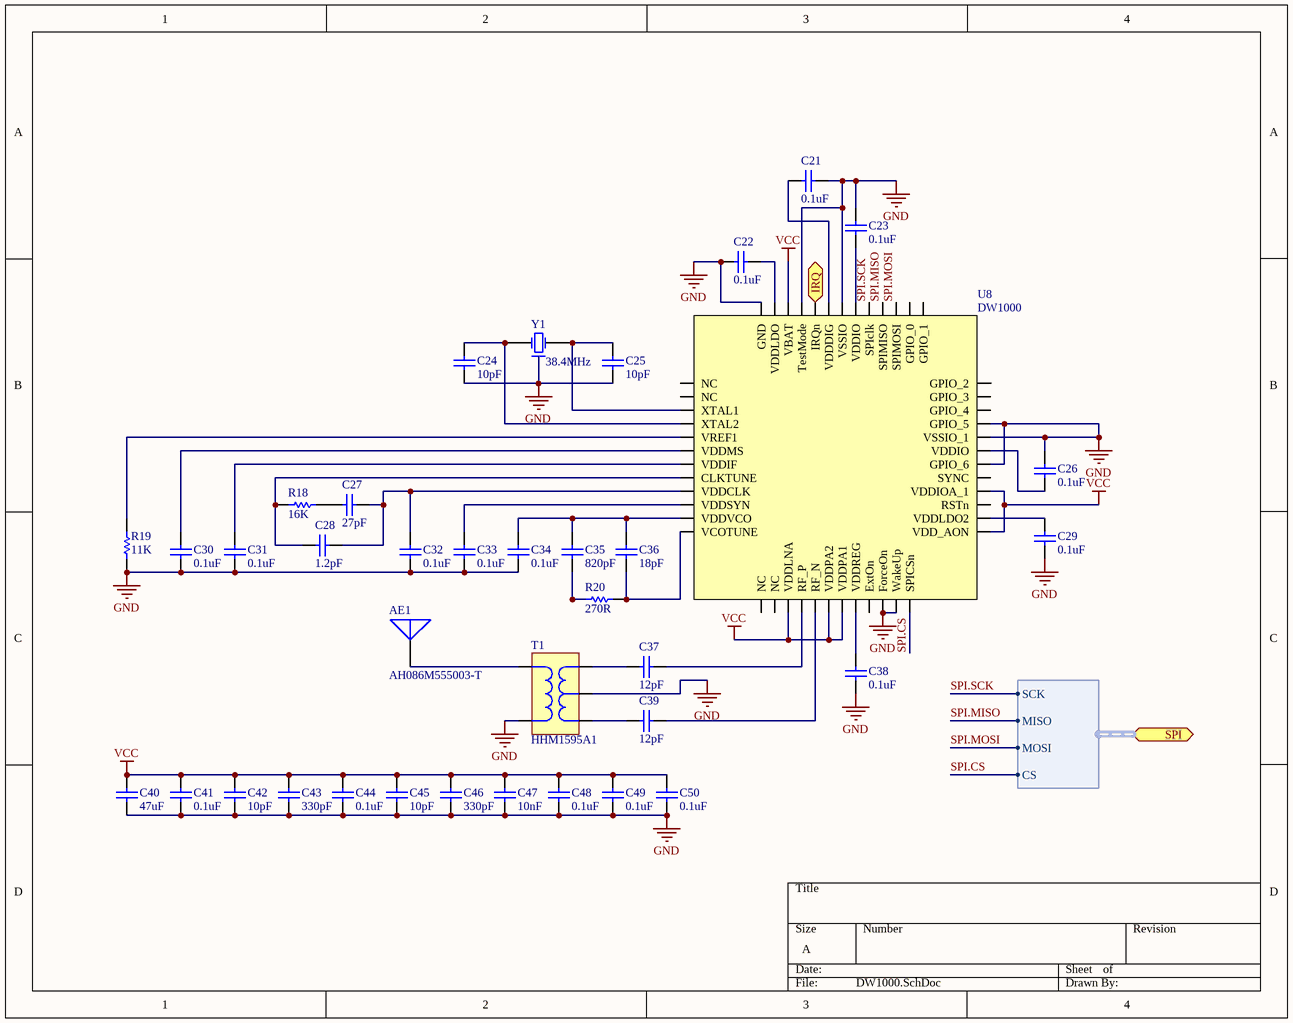
[diagram p8: DW1000.SchDoc]

### Parts
AE1  AH086M555003-T  [AH086M555003-T]
C21  value 0.1uF  [C0402[1005X55]]  (hidden comment: 0.1uF 6.3V 0402)
C22  value 0.1uF  [C0402[1005X55]]  (hidden comment: 0.1uF 6.3V 0402)
C23  value 0.1uF  [C0402[1005X55]]  (hidden comment: 0.1uF 6.3V 0402)
C24  value 10pF  [C0402[1005X55]]  (hidden comment: 10pF 50V 0402)
C25  value 10pF  [C0402[1005X55]]  (hidden comment: 10pF 50V 0402)
C26  value 0.1uF  [C0402[1005X55]]  (hidden comment: 0.1uF 6.3V 0402)
C27  value 27pF  [C0402[1005X55]]  (hidden comment: 27pF 50V 0402)
C28  value 1.2pF  [C0402[1005X55]]  (hidden comment: 1.2pF 50V 0402)
C29  value 0.1uF  [C0402[1005X55]]  (hidden comment: 0.1uF 6.3V 0402)
C30  value 0.1uF  [C0402[1005X55]]  (hidden comment: 0.1uF 6.3V 0402)
C31  value 0.1uF  [C0402[1005X55]]  (hidden comment: 0.1uF 6.3V 0402)
C32  value 0.1uF  [C0402[1005X55]]  (hidden comment: 0.1uF 6.3V 0402)
C33  value 0.1uF  [C0402[1005X55]]  (hidden comment: 0.1uF 6.3V 0402)
C34  value 0.1uF  [C0402[1005X55]]  (hidden comment: 0.1uF 6.3V 0402)
C35  value 820pF  [C0402[1005X55]]  (hidden comment: 820pF 50V 0402)
C36  value 18pF  [C0402[1005X55]]  (hidden comment: 18pF 50V 0402)
C37  value 12pF  [C0402[1005X55]]  (hidden comment: 12pF 50V 0402)
C38  value 0.1uF  [C0402[1005X55]]  (hidden comment: 0.1uF 6.3V 0402)
C39  value 12pF  [C0402[1005X55]]  (hidden comment: 12pF 50V 0402)
C40  value 47uF  [C1206[3216X160]]  (hidden comment: 47uF 6.3V 1206)
C41  value 0.1uF  [C0402[1005X55]]  (hidden comment: 0.1uF 6.3V 0402)
C42  value 10pF  [C0402[1005X55]]  (hidden comment: 10pF 50V 0402)
C43  value 330pF  [C0402[1005X55]]  (hidden comment: 330pF 50V 0402)
C44  value 0.1uF  [C0402[1005X55]]  (hidden comment: 0.1uF 6.3V 0402)
C45  value 10pF  [C0402[1005X55]]  (hidden comment: 10pF 50V 0402)
C46  value 330pF  [C0402[1005X55]]  (hidden comment: 330pF 50V 0402)
C47  value 10nF  [C0402[1005X55]]  (hidden comment: 10nF 50V 0402)
C48  value 0.1uF  [C0402[1005X55]]  (hidden comment: 0.1uF 6.3V 0402)
C49  value 0.1uF  [C0402[1005X55]]  (hidden comment: 0.1uF 6.3V 0402)
C50  value 0.1uF  [C0402[1005X55]]  (hidden comment: 0.1uF 6.3V 0402)
R18  value 16K  [R0402[1005]]  (hidden comment: 16K 1% 0402)
R19  value 11K  [R0402[1005]]  (hidden comment: 11K 1% 0402)
R20  value 270R  [R0402[1005]]  (hidden comment: 270R 1% 0402)
T1  HHM1595A1  [HHM1595A1]
U8  DW1000  [QFN-48]
Y1  38.4MHz  [ABRA-ABM10]

### Ports
IRQ (out), SPI (harness SPI)

### Harnesses
SPI: SCK, MISO, MOSI, CS

### Nets
GND: C21.1 C22.2 C23.2 C24.1 C25.1 C26.2 C29.1 C30.1 C31.1 C32.1 C33.1 C34.1 C38.1 C40.1 C41.1 C42.1 C43.1 C44.1 C45.1 C46.1 C47.1 C48.1 C49.1 C50.1 R19.1 T1.2 T1.5 U8.22(ForceOn) U8.23(WakeUp) U8.30(GPIO_6) U8.32(VSSIO_1) U8.33(GPIO_5) U8.43(VSSIO) U8.46(TestMode) U8.49(GND) Y1.2
VCC: C40.2 C41.2 C42.2 C43.2 C44.2 C45.2 C46.2 C47.2 C48.2 C49.2 C50.2 U8.15(VDDLNA) U8.18(VDDPA2) U8.19(VDDPA1) U8.25(VDD_AON) U8.28(VDDIOA_1) U8.47(VBAT)
SPI.CS: U8.24(SPICSn) ; port SPI.CS
SPI.MISO: U8.40(SPIMISO) ; port SPI.MISO
SPI.MOSI: U8.39(SPIMOSI) ; port SPI.MOSI
SPI.SCK: U8.41(SPIclk) ; port SPI.SCK
NetAE1_1: AE1.1 T1.1
NetC21_2: C21.2 U8.44(VDDDIG)
NetC22_1: C22.1 U8.48(VDDLDO)
NetC23_1: C23.1 U8.42(VDDIO)
NetC24_2: C24.2 U8.4(XTAL2) Y1.1(X1)
NetC25_2: C25.2 U8.3(XTAL1) Y1.3(X2)
NetC26_1: C26.1 U8.31(VDDIO)
NetC27_1: C27.1 C28.1 C32.2 U8.9(VDDCLK)
NetC27_2: C27.2 R18.1
NetC28_2: C28.2 R18.2 U8.8(CLKTUNE)
NetC29_2: C29.2 U8.26(VDDLDO2)
NetC30_2: C30.2 U8.6(VDDMS)
NetC31_2: C31.2 U8.7(VDDIF)
NetC33_2: C33.2 U8.10(VDDSYN)
NetC34_2: C34.2 C35.2 C36.2 U8.11(VDDVCO)
NetC35_1: C35.1 R20.1
NetC36_1: C36.1 R20.2 U8.12(VCOTUNE)
NetC37_1: C37.1 T1.4
NetC37_2: C37.2 U8.16(RF_P)
NetC38_2: C38.2 U8.20(VDDREG)
NetC39_1: C39.1 T1.3
NetC39_2: C39.2 U8.17(RF_N)
NetR19_2: R19.2 U8.5(VREF1)
NetU1_54: U8.45(IRQn) ; port IRQ

Not connected (* = marked no-connect by the designer): U8 1(NC) 2(NC) 13(NC) 14(NC) 21(ExtOn) 27(RSTn) 29(SYNC) 34(GPIO_4) 35(GPIO_3) 36(GPIO_2) 37(GPIO_1) 38(GPIO_0)

### Library data of the parts
AE1 = AH086M555003-T: Manufacturer: Taiyo Yuden; PartNumber: AH086M555003-T; Mounting Technology: Surface Mount
C21-C23 C26 C29-C34 C38 C41 C44 C48-C50 = CAP_0.1uF_6.3V_0402_10%: as C72 on sheet LED; Mounting Technology: Surface Mount; PackageReference: 0402; PackageDescription: 0402 (1005 Metric); Voltage: 6.3V; Tolerance: 10%
C24 C25 C42 C45 = CAP_10pF_50V_0402_1%: 10pF 50V 1% 0402 (1005 Metric); PartNumber: GRM1555C1H100FA01D; Manufacturer: Murata; Mounting Technology: Surface Mount; PackageReference: 0402; PackageDescription: 0402 (1005 Metric); Voltage: 50V; Tolerance: 1%
C27 = CAP_27pF_50V_0402_1%: 27pF 50V 1% 0402 (1005 Metric); PartNumber: GRM1555C1H270FA01D; Manufacturer: Murata; Mounting Technology: Surface Mount; PackageReference: 0402; PackageDescription: 0402 (1005 Metric); Voltage: 50V; Tolerance: 1%
C28 = CAP_1.2pF_50V_0402_0.05pF: 1.2pF 50V 0.05pF 0402 (1005 Metric); PartNumber: GRM1555C1H1R2WA01D; Manufacturer: Murata; Mounting Technology: Surface Mount; PackageReference: 0402; PackageDescription: 0402 (1005 Metric); Voltage: 50V; Tolerance: 0.05pF
C35 = CAP_820pF_50V_0402_5%: 820pF 50V 5% 0402 (1005 Metric); PartNumber: GRM1555C1H821JA01D; Manufacturer: Murata; Mounting Technology: Surface Mount; PackageReference: 0402; PackageDescription: 0402 (1005 Metric); Voltage: 50V; Tolerance: 5%
C36 = CAP_18pF_50V_0402_1%: 18pF 50V 1% 0402 (1005 Metric); PartNumber: GRM1555C1H180FA01D; Manufacturer: Murata; Mounting Technology: Surface Mount; PackageReference: 0402; PackageDescription: 0402 (1005 Metric); Voltage: 50V; Tolerance: 1%
C37 C39 = CAP_12pF_50V_0402_5%: 12pF 50V 5% 0402 (1005 Metric); PartNumber: GRM1555C1H120JA01D; Manufacturer: Murata; Mounting Technology: Surface Mount; PackageReference: 0402; PackageDescription: 0402 (1005 Metric); Voltage: 50V; Tolerance: 5%
C40 = CAP_47uF_6.3V_1206_10%: as C71 on sheet MotorDriver; Mounting Technology: Surface Mount; PackageReference: 1206; PackageDescription: 1206 (3216 Metric); Voltage: 6.3V; Tolerance: 10%
C43 C46 = CAP_330pF_50V_0402_5%: 330pF 50V 5% 0402 (1005 Metric); PartNumber: GRM1555C1H331JA01D; Manufacturer: Murata; Mounting Technology: Surface Mount; PackageReference: 0402; PackageDescription: 0402 (1005 Metric); Voltage: 50V; Tolerance: 5%
C47 = CAP_10nF_50V_0402_10%: as C69 on sheet MotorDriver; Mounting Technology: Surface Mount; PackageReference: 0402; PackageDescription: 0402 (1005 Metric); Voltage: 50V; Tolerance: 10%
R18 = RES_16K_0402_1%: 16K 0.063W 1% 0402 (1005 Metric); Manufacturer: KOA Speer; PartNumber: RK73H1ETTP1602F; Tolerance: 1%; Power: 0.063W; Mounting Technology: Surface Mount; PackageReference: 0402; PackageDescription: 0402 (1005 Metric); ComponentLink1Description: Datasheet; ComponentLink1URL: http://www.koaspeer.com/catimages/Products/RK73H/RK73H.pdf
R19 = RES_11K_0402_1%: 11K 0.063W 1% 0402 (1005 Metric); Manufacturer: KOA Speer; PartNumber: RK73H1ETTP1102F; Tolerance: 1%; Power: 0.063W; Mounting Technology: Surface Mount; PackageReference: 0402; PackageDescription: 0402 (1005 Metric); ComponentLink1Description: Datasheet; ComponentLink1URL: http://www.koaspeer.com/catimages/Products/RK73H/RK73H.pdf
R20 = RES_270R_0402_1%: 270R 0.063W 1% 0402 (1005 Metric); Manufacturer: KOA Speer; PartNumber: RK73H1ETTP2700F; Tolerance: 1%; Power: 0.063W; Mounting Technology: Surface Mount; PackageReference: 0402; PackageDescription: 0402 (1005 Metric); ComponentLink1Description: Datasheet; ComponentLink1URL: http://www.koaspeer.com/catimages/Products/RK73H/RK73H.pdf
T1 = HHM1595A1: Manufacturer: TDK; PartNumber: HHM1595A1; PackageReference: 0805; Mounting Technology: Surface Mount
U8 = DW1000: UWB DW1000; Part Number: DW1000-I-TR13; Manufacturer: Decawave Limited; PackageReference: QFN-48; Mounting Technology: Surface Mount
Y1 = ABM10-165-38.400MHZ-T3: Manufacturer: ABRACON; PartNumber: ABM10-165-38.400MHZ-T3; Mounting Technology: Surface Mount; PackageReference: 4-SMD; PackageDescription: 4-SMD, No Lead (DFN, LCC)

## Sheet Power.SchDoc
size A; SheetNumber: 3
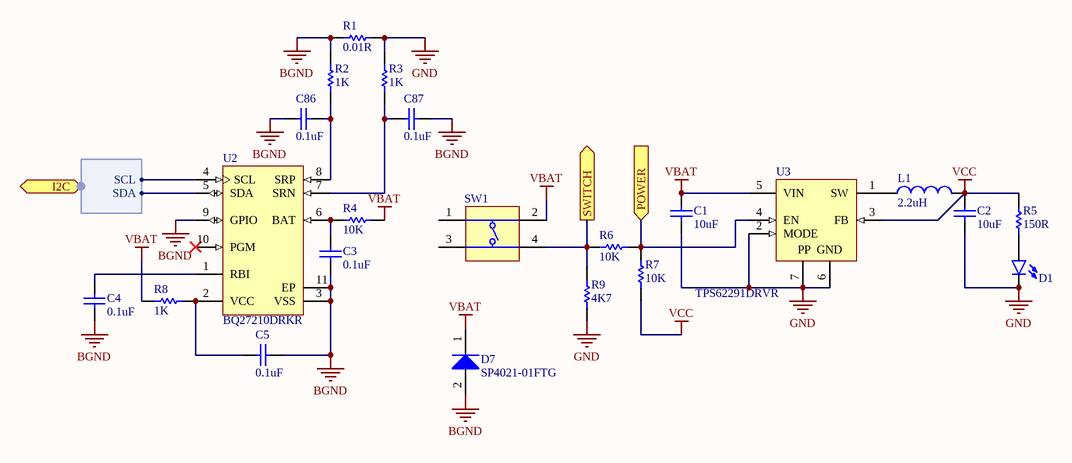
[diagram p9: Power.SchDoc]

### Parts
C1  value 10uF  [C0402[1005X55]]  (hidden comment: 10uF 6.3V 0402)
C2  value 10uF  [C0402[1005X55]]  (hidden comment: 10uF 6.3V 0402)
C3  value 0.1uF  [C0402[1005X55]]  (hidden comment: 0.1uF 100V 0402)
C4  value 0.1uF  [C0402[1005X55]]  (hidden comment: 0.1uF 100V 0402)
C5  value 0.1uF  [C0402[1005X55]]  (hidden comment: 0.1uF 100V 0402)
C86  value 0.1uF  [C0402[1005X55]]  (hidden comment: 0.1uF 100V 0402)
C87  value 0.1uF  [C0402[1005X55]]  (hidden comment: 0.1uF 100V 0402)
D1  LED_0603_BLUE_5mA  [LED0603]  (value not drawn)
D7  SP4021-01FTG  [SOD-323]
L1  2.2uH  [IND0805]
R1  value 0.01R  [R1206[3216]]  (hidden comment: 0.01R 1% 1206)
R2  value 1K  [R0402[1005]]  (hidden comment: 1K 1% 0402)
R3  value 1K  [R0402[1005]]  (hidden comment: 1K 1% 0402)
R4  value 10K  [R0402[1005]]  (hidden comment: 10K 1% 0402)
R5  value 150R  [R0402[1005]]  (hidden comment: 150R 1% 0402)
R6  value 10K  [R0402[1005]]  (hidden comment: 10K 1% 0402)
R7  value 10K  [R0402[1005]]  (hidden comment: 10K 1% 0402)
R8  value 1K  [R0402[1005]]  (hidden comment: 1K 1% 0402)
R9  value 4K7  [R0402[1005]]  (hidden comment: 4K7 1% 0402)
SW1  (no value)  [SWITCH]
U2  BQ27210DRKR  [VSON-10]
U3  TPS62291DRVR  [WSON-6]

### Ports
I2C (harness I2C), POWER (in), SWITCH (out)

### Harnesses
I2C: SCL, SDA

### Nets
BGND: C3.1 C4.1 C5.2 C86.1 C87.2 D7.2(A) R1.1 R2.2 U2.3(VSS) U2.9(GPIO) U2.11(EP)
GND: C1.1 C2.1 D1.C R1.2 R3.2 R9.1 U3.2(MODE) U3.6(GND) U3.7(EP)
VBAT: C1.2 D7.1(K) R4.2 R8.2 SW1.2(T2) U3.5(VIN)
VCC: C2.2 L1.2 R5.1 R7.1 U3.3(FB)
I2C.SCL: U2.4(SCL) ; port I2C.SCL
I2C.SDA: U2.5(SDA) ; port I2C.SDA
NetC3_2: C3.2 R4.1 U2.6(BAT)
NetC4_2: C4.2 U2.1(RBI)
NetC5_1: C5.1 R8.1 U2.2(VCC)
NetC86_2: C86.2 R2.1 U2.8(SRP)
NetC87_1: C87.1 R3.1 U2.7(SRN)
NetD1_A: D1.A R5.2
NetL1_1: L1.1 U3.1(SW)
NetR6_1: R6.1 R9.2 SW1.4(T3) ; port SWITCH
NetR6_2: R6.2 R7.2 U3.4(EN) ; port POWER

Not connected (* = marked no-connect by the designer): SW1 1(T1) 3(T3); U2 10(PGM)*

### Notes on the sheet
- (in symbol TPS62291DRVR) PP

### Library data of the parts
C1 C2 = CAP_10uF_6.3V_0402_20%: as C8 on sheet Charging; Tolerance: 20%; Mounting Technology: Surface Mount; PackageReference: 0402; PackageDescription: 0402 (1005 Metric); Voltage: 6.3V
C3-C5 C86 C87 = CAP_0.1uF_100V_0402_10%: as C80 on sheet Charging; Mounting Technology: Surface Mount; PackageReference: 0402; PackageDescription: 0402 (1005 Metric); Voltage: 100V; Tolerance: 10%
D1 = LED_0603_BLUE_5mA: PartNumber: LTST-C193TBKT-5A; Manufacturer: Lite-On Inc.; PackageReference: 0603; PackageDescription: 0603 (1608 Metric); Mounting Technology: Surface Mount
D7 = SP4021-01FTG: Manufacturer: Littelfuse; PartNumber: SP4021-01FTG; PackageReference: SOD-323-2; Mounting Technology: Surface Mount
L1 = IND_2.2uH_1.7A_0805_20%: 2.2uH 20% 1.7A 0805; PartNumber: LQM21PN2R2MGHL; Manufacturer: Murata; PackageReference: 0805; PackageDescription: 0805 (2012 metric); Value: 2.2uH; Mounting Technology: Surface Mount; Current: 1.7A
R1 = RES_0.01R_1206_1%_1.5W: 0.01R 1.5W 1% 1206 (3216 Metric); Manufacturer: KOA Speer; PartNumber: TLR2BPDTD10L0F75; Tolerance: 1%; Power: 1.5W; Mounting Technology: Surface Mount; PackageReference: 1206; PackageDescription: 1206 (3216 Metric)
R2 R3 R8 = RES_1K_0402_1%: as R10 on sheet Charging; Tolerance: 1%; Power: 0.063W; Mounting Technology: Surface Mount; PackageReference: 0402; PackageDescription: 0402 (1005 Metric); ComponentLink1Description: Datasheet; ComponentLink1URL: http://www.koaspeer.com/catimages/Products/RK73H/RK73H.pdf
R4 R6 R7 = RES_10K_0402_1%: as R17 on sheet DistanceSensorFront; Tolerance: 1%; Power: 0.063W; Mounting Technology: Surface Mount; PackageReference: 0402; PackageDescription: 0402 (1005 Metric); ComponentLink1Description: Datasheet; ComponentLink1URL: http://www.koaspeer.com/catimages/Products/RK73H/RK73H.pdf
R5 = RES_150R_0402_1%: 150R 0.063W 1% 0402 (1005 Metric); Manufacturer: KOA Speer; PartNumber: RK73H1ETTP1500F; Tolerance: 1%; Power: 0.063W; Mounting Technology: Surface Mount; PackageReference: 0402; PackageDescription: 0402 (1005 Metric); ComponentLink1Description: Datasheet; ComponentLink1URL: http://www.koaspeer.com/catimages/Products/RK73H/RK73H.pdf
R9 = RES_4K7_0402_1%: as R23 on sheet LED; Tolerance: 1%; Power: 0.063W; Mounting Technology: Surface Mount; PackageReference: 0402; PackageDescription: 0402 (1005 Metric); ComponentLink1Description: Datasheet; ComponentLink1URL: http://www.koaspeer.com/catimages/Products/RK73H/RK73H.pdf
SW1 = DIPT-DTSM-6: as BOOT on sheet MCU; ComponentLink2URL: http://www.dip.com.tw/Products_tact.htm; ComponentLink1URL: http://www.dip.com.tw/; ComponentLink3URL: http://www.dip.com.tw/PDF/pro_tact/DTSM_G_-6_2_-V.pdf; PackageDescription: Switch, Surface Mount, 4 Leads, Body 4.6x2.8mm, Height 1.9mm; ComponentLink2Description: Datasheet; ComponentLink3Description: Package Specification; ComponentLink1Description: Manufacturer URL; PackageReference: PTS810; Mounting Technology: Surface Mount
U2 = BQ27210DRKR: Manufacturer: Texas Instruments; PackageReference: VSON-10; PartNumber: BQ27210DRKR; Mounting Technology: Surface Mount
U3 = TPS62291DRVR: Voltage Regulators - Switching Regulators 2.25MHz 1A Step-Down Cnvrtr 3.3V Output; Manufacturer: Texas Instruments; PartNumber: TPS62291DRVR; PackageReference: WSON-6; PackageDescription: SON, 6-Leads, Body 2x2mm, Pitch 0.65mm, Thermal Pad 1.6x1mm, TI Recommended; Mounting Technology: Surface Mount

## Sheet IR.SchDoc
size A
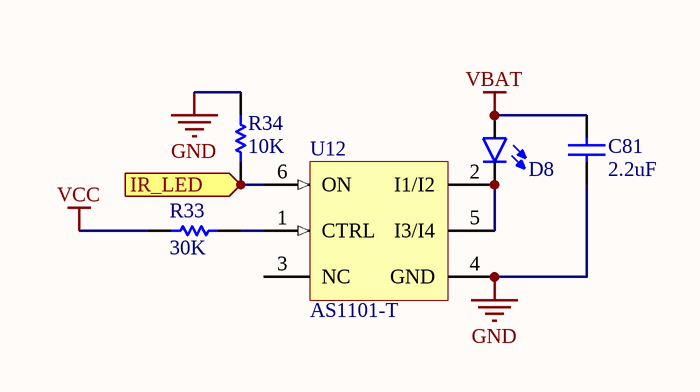
[diagram p10: IR.SchDoc]

### Parts
C81  value 2.2uF  [C0402[1005X55]]  (hidden comment: 2.2uF 6.3V 0402)
D8  SFH 4046  [LED1206]  (value not drawn)
R33  value 30K  [R0402[1005]]  (hidden comment: 30K 1% 0402)
R34  value 10K  [R0402[1005]]  (hidden comment: 10K 1% 0402)
U12  AS1101-T  [AMS-SC70-6-2000X1250DE_N]

### Ports
IR_LED (in)

### Nets
GND: C81.1 R34.2 U12.4(GND)
VBAT: C81.2 D8.A
VCC: R33.1
NetD8_C: D8.C U12.2(I1/I2) U12.5(I3/I4)
NetR33_2: R33.2 U12.1(CTRL)
NetR34_1: R34.1 U12.6(ON) ; port IR_LED

Not connected (* = marked no-connect by the designer): U12 3(NC)

### Library data of the parts
C81 = CAP_2.2uF_6.3V_0402_20%: as C70 on sheet MotorDriver; Mounting Technology: Surface Mount; PackageReference: 0402; PackageDescription: 0402 (1005 Metric); Voltage: 6.3V; Tolerance: 20%
D8 = SFH 4046: Manufacturer: Osram; PartNumber: SFH 4046; PackageReference: 1206; PackageDescription: 1206 (3216 Metric); Mounting Technology: Surface Mount
R33 = RES_30K_0402_1%: 30K 0.063W 1% 0402 (1005 Metric); Manufacturer: KOA Speer; PartNumber: RK73H1ETTP3002F; Tolerance: 1%; Power: 0.063W; Mounting Technology: Surface Mount; PackageReference: 0402; PackageDescription: 0402 (1005 Metric); ComponentLink1Description: Datasheet; ComponentLink1URL: http://www.koaspeer.com/catimages/Products/RK73H/RK73H.pdf
R34 = RES_10K_0402_1%: as R17 on sheet DistanceSensorFront; Tolerance: 1%; Power: 0.063W; Mounting Technology: Surface Mount; PackageReference: 0402; PackageDescription: 0402 (1005 Metric); ComponentLink1Description: Datasheet; ComponentLink1URL: http://www.koaspeer.com/catimages/Products/RK73H/RK73H.pdf
U12 = CMP-0558-00027-2: 80 mA, Simple Drive, Dual LED Driver with Enable, 2.2 to 3.6 V, SC70-6, Reel; Manufacturer: AMS; LED-to-LED Matching (%): 3; LED Current per Output (mA): 80; Outputs: 2; ComponentLink1URL: www.ams.com; Mounting Technology: Surface Mount; PartNumber: AS1101-T; ComponentLink2Description: Datasheet; PackageDescription: 6-Pin SOT23, 2 x 1.25 mm Body, 0.65 mm Pitch; Supply Voltage (V): 2.2 to 3.6; ComponentLink1Description: Manufacturer URL; Code_JEDEC: MO-203; PackageVersion: Rev. 1.5, 09/2007; PackageReference: SC70-6; ComponentLink2URL: http://www.ams.com/eng/content/download/1193/6938/515; Features: Simple Drive; DatasheetVersion: Rev. 1.5

## Sheet DistanceSensorBottom.SchDoc
size A
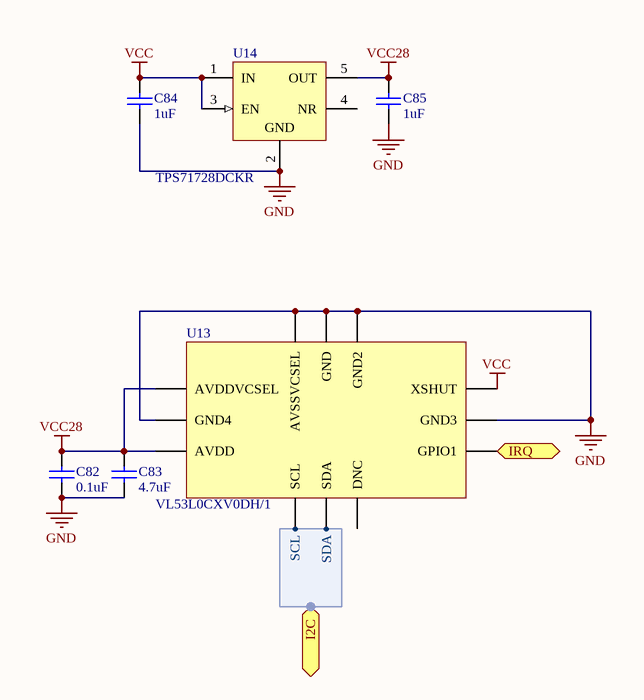
[diagram p11: DistanceSensorBottom.SchDoc]

### Parts
C82  value 0.1uF  [C0402[1005X55]]  (hidden comment: 0.1uF 6.3V 0402)
C83  value 4.7uF  [C0402[1005X55]]  (hidden comment: 4.7uF 6.3V 0402)
C84  value 1uF  [C0402[1005X55]]  (hidden comment: 1uF 6.3V 0402)
C85  value 1uF  [C0402[1005X55]]  (hidden comment: 1uF 6.3V 0402)
U13  VL53L0CXV0DH/1  [LGA-12]
U14  TPS71728DCKR  [DCK0005A_M]

### Ports
I2C (harness I2C), IRQ (out)

### Harnesses
I2C: SCL, SDA

### Nets
GND: C82.1 C83.1 C84.1 C85.1 U13.2(AVSSVCSEL) U13.3(GND) U13.4(GND2) U13.6(GND3) U13.12(GND4) U14.2(GND)
VCC: C84.2 U13.5(XSHUT) U14.1(IN) U14.3(EN)
VCC28: C82.2 C83.2 C85.2 U13.1(AVDDVCSEL) U13.11(AVDD) U14.5(OUT)
I2C.SCL: U13.10(SCL) ; port I2C.SCL
I2C.SDA: U13.9(SDA) ; port I2C.SDA
NetU1_26: U13.7(GPIO1) ; port IRQ

Not connected (* = marked no-connect by the designer): U13 8(DNC); U14 4(NR)

### Library data of the parts
C82 = CAP_0.1uF_6.3V_0402_10%: as C72 on sheet LED; Mounting Technology: Surface Mount; PackageReference: 0402; PackageDescription: 0402 (1005 Metric); Voltage: 6.3V; Tolerance: 10%
C83 = CAP_4.7uF_6.3V_0402_20%: as C57 on sheet MCU; Mounting Technology: Surface Mount; PackageReference: 0402; PackageDescription: 0402 (1005 Metric); Voltage: 6.3V; Tolerance: 20%
C84 C85 = CAP_1uF_6.3V_0402_10%: as C15 on sheet DistanceSensorFront; Mounting Technology: Surface Mount; PackageReference: 0402; PackageDescription: 0402 (1005 Metric); Voltage: 6.3V; Tolerance: 10%
U13 = VL53L0CXV0DH/1: Optical Sensor Modules Time-of-Flight (ToF) ranging sensor; Manufacturer: STMicroelectronics; PartNumber: VL53L0CXV0DH/1; Mounting Technology: Surface Mount; PackageReference: LGA-12
U14 = CMP-0394-00823-2: Single Output High PSRR LDO, 150 mA, Fixed 2.8 V Output, 2.5 to 6.5 V Input, with Low IQ, 5-pin SC70 (DCK), -40 to 85 degC, Green (RoHS & no Sb/Br); Manufacturer: Texas Instruments; Vout Adj(Max)(V): 2.8; Accuracy(%): 3; Iout(Max)(A): 0.15; SubFamily: Single Channel LDO; Vdo(Typ)(mV): 170; Vin(Max)(V): 6.5; Vin(Min)(V): 2.5; Iq(Typ)(mA): 0.05; PackageVersion: 4093553-3/G; PartNumber: TPS71728DCKR; Fixed Output Options(V): 2.8; ComponentLink3Description: Package Specification; ComponentLink1URL: http://www.ti.com/; ComponentLink2Description: Datasheet; PackageReference: DCK0005A; DatasheetVersion: SBVS068G; PackageDescription: 5-Pin Plastic Small-Outline, Body 2 x 1.25 mm, Pitch 0.65 mm; ComponentLink1Description: Manufacturer URL; ComponentLink3URL: http://www.ti.com/litv/pdf/mpds025f; Mounting Technology: Surface Mount; ComponentLink2URL: http://www.ti.com/general/docs/lit/getliterature.tsp?genericPartNumber=TPS71728&fileType=pdf; Code_JEDEC: MO-203; Vout Adj(Min)(V): 2.8; Eco-Plan: Green (RoHS & no Sb/Br)